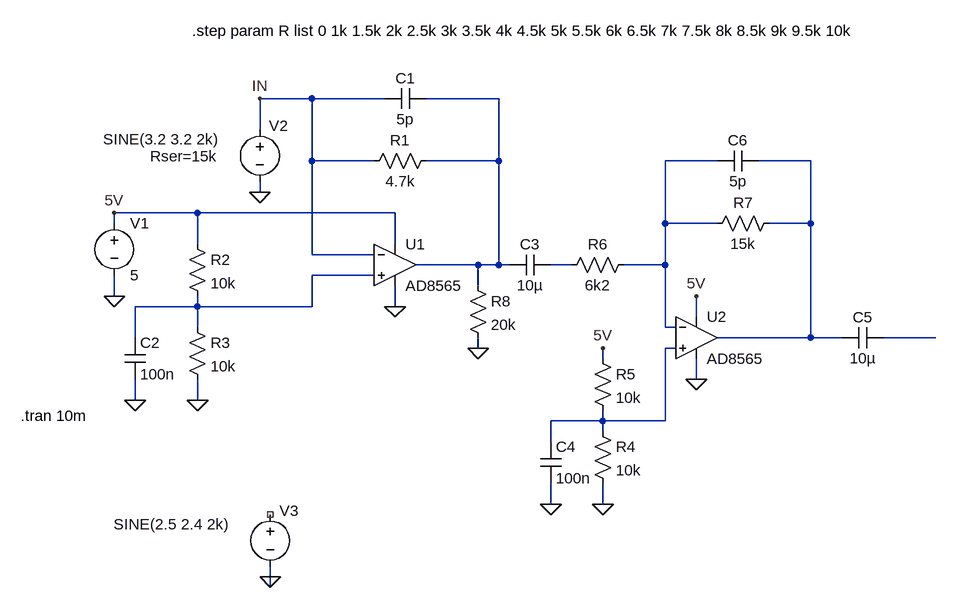
[diagram p0: schematic Amplifier.asc]
Amplifier.asc, the LTspice schematic file:
Version 4
SHEET 1 2068 1188
WIRE 432 -144 352 -144
WIRE 544 -144 432 -144
WIRE 720 -144 608 -144
WIRE 352 -96 352 -144
WIRE 432 -48 432 -144
WIRE 528 -48 432 -48
WIRE 720 -48 720 -144
WIRE 720 -48 608 -48
WIRE 1056 -48 976 -48
WIRE 1200 -48 1120 -48
WIRE 352 0 352 -16
WIRE 256 32 128 32
WIRE 560 32 256 32
WIRE 128 48 128 32
WIRE 976 48 976 -48
WIRE 1056 48 976 48
WIRE 1200 48 1200 -48
WIRE 1200 48 1136 48
WIRE 256 80 256 32
WIRE 560 80 560 32
WIRE 432 96 432 -48
WIRE 528 96 432 96
WIRE 688 112 592 112
WIRE 720 112 720 -48
WIRE 720 112 688 112
WIRE 736 112 720 112
WIRE 832 112 800 112
WIRE 976 112 976 48
WIRE 976 112 912 112
WIRE 528 128 432 128
WIRE 688 144 688 112
WIRE 128 160 128 128
WIRE 256 176 256 160
WIRE 256 176 160 176
WIRE 432 176 432 128
WIRE 432 176 256 176
WIRE 560 176 560 144
WIRE 1024 192 1024 160
WIRE 256 208 256 176
WIRE 976 208 976 112
WIRE 992 208 976 208
WIRE 160 224 160 176
WIRE 1200 224 1200 48
WIRE 1200 224 1056 224
WIRE 1248 224 1200 224
WIRE 1392 224 1312 224
WIRE 688 240 688 224
WIRE 992 240 976 240
WIRE 880 256 880 240
WIRE 1024 288 1024 256
WIRE 160 320 160 288
WIRE 256 320 256 288
WIRE 880 352 880 336
WIRE 880 352 800 352
WIRE 976 352 976 240
WIRE 976 352 880 352
WIRE 880 368 880 352
WIRE 800 384 800 352
WIRE 800 480 800 448
WIRE 880 480 880 448
WIRE 368 592 368 576
WIRE 368 608 368 592
FLAG 128 160 0
FLAG 560 176 0
FLAG 256 320 0
FLAG 160 320 0
FLAG 352 0 0
FLAG 352 -144 IN
FLAG 128 32 5V
FLAG 1024 160 5V
FLAG 1024 288 0
FLAG 880 240 5V
FLAG 880 480 0
FLAG 800 480 0
FLAG 688 240 0
FLAG 368 592 0
SYMBOL voltage 128 32 R0
WINDOW 123 0 0 Left 0
WINDOW 39 0 0 Left 0
SYMATTR InstName V1
SYMATTR Value 5
SYMBOL Opamps\\AD8565 560 48 R0
SYMATTR InstName U1
SYMBOL res 624 -64 R90
WINDOW 0 0 56 VBottom 2
WINDOW 3 32 56 VTop 2
SYMATTR InstName R1
SYMATTR Value 4.7k
SYMBOL cap 608 -160 R90
WINDOW 0 0 32 VBottom 2
WINDOW 3 32 32 VTop 2
SYMATTR InstName C1
SYMATTR Value 5p
SYMBOL res 240 64 R0
SYMATTR InstName R2
SYMATTR Value 10k
SYMBOL res 240 192 R0
SYMATTR InstName R3
SYMATTR Value 10k
SYMBOL cap 144 224 R0
SYMATTR InstName C2
SYMATTR Value 100n
SYMBOL voltage 352 -112 R0
WINDOW 0 14 10 Left 2
WINDOW 3 -241 31 Left 2
WINDOW 123 24 72 Left 2
WINDOW 39 -169 57 Left 2
SYMATTR InstName V2
SYMATTR Value SINE(3.2 3.2 2k)
SYMATTR SpiceLine Rser=15k
SYMBOL Opamps\\AD8565 1024 160 R0
SYMATTR InstName U2
SYMBOL res 864 352 R0
SYMATTR InstName R4
SYMATTR Value 10k
SYMBOL res 864 240 R0
SYMATTR InstName R5
SYMATTR Value 10k
SYMBOL res 928 96 R90
WINDOW 0 0 56 VBottom 2
WINDOW 3 32 56 VTop 2
SYMATTR InstName R6
SYMATTR Value 6k2
SYMBOL res 1152 32 R90
WINDOW 0 0 56 VBottom 2
WINDOW 3 32 56 VTop 2
SYMATTR InstName R7
SYMATTR Value 15k
SYMBOL cap 784 384 R0
SYMATTR InstName C4
SYMATTR Value 100n
SYMBOL cap 1312 208 R90
WINDOW 0 0 32 VBottom 2
WINDOW 3 32 32 VTop 2
SYMATTR InstName C5
SYMATTR Value 10µ
SYMBOL cap 800 96 R90
WINDOW 0 0 32 VBottom 2
WINDOW 3 32 32 VTop 2
SYMATTR InstName C3
SYMATTR Value 10µ
SYMBOL cap 1120 -64 R90
WINDOW 0 0 32 VBottom 2
WINDOW 3 32 32 VTop 2
SYMATTR InstName C6
SYMATTR Value 5p
SYMBOL res 672 128 R0
SYMATTR InstName R8
SYMATTR Value 20k
SYMBOL voltage 368 480 R0
WINDOW 0 14 10 Left 2
WINDOW 3 -241 31 Left 2
WINDOW 123 24 72 Left 2
WINDOW 39 -169 57 Left 2
SYMATTR InstName V3
SYMATTR Value SINE(2.5 2.4 2k)
TEXT -16 344 Left 2 !.tran 10m
TEXT 248 -248 Left 2 !.step param R list 0 1k 1.5k 2k 2.5k 3k 3.5k 4k 4.5k 5k 5.5k 6k 6.5k 7k 7.5k 8k 8.5k 9k 9.5k 10k

The netlist it stands for:
* Amplifier.asc
V1 5V 0 5
XU1 N005 IN 5V 0 N001 AD8565  ; pins In+ In- V+ V- OUT
R1 N001 IN 4.7k
C1 N001 IN 5p
R2 5V N005 10k
R3 N005 0 10k
C2 N005 0 100n
V2 IN 0 SINE(3.2 3.2 2k) Rser=15k
XU2 N007 N002 5V 0 N003 AD8565  ; pins In+ In- V+ V- OUT
R4 N007 0 10k
R5 5V N007 10k
R6 N002 N004 6k2
R7 N003 N002 15k
C4 N007 0 100n
C5 N006 N003 10µ
C3 N004 N001 10µ
C6 N003 N002 5p
R8 N001 0 20k
V3 NC_01 0 SINE(2.5 2.4 2k)
.tran 10m
.step param R list 0 1k 1.5k 2k 2.5k 3k 3.5k 4k 4.5k 5k 5.5k 6k 6.5k 7k 7.5k 8k 8.5k 9k 9.5k 10k
.backanno
.end